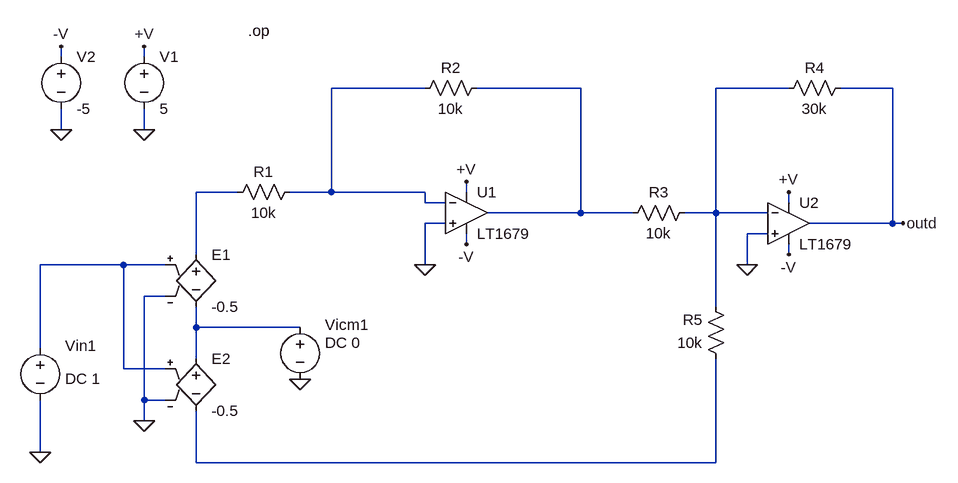
[diagram p0: schematic Etaj_1_AI_2AO_inv_op.asc]
Etaj_1_AI_2AO_inv_op.asc, the LTspice schematic file:
Version 4.1
SHEET 1 904 680
WIRE -480 -240 -480 -256
WIRE -352 -240 -352 -256
WIRE 80 -192 -64 -192
WIRE 320 -192 160 -192
WIRE 640 -192 528 -192
WIRE 800 -192 720 -192
WIRE -480 -128 -480 -160
WIRE -352 -128 -352 -160
WIRE -208 -32 -272 -32
WIRE -64 -32 -64 -192
WIRE -64 -32 -128 -32
WIRE 80 -32 -64 -32
WIRE 144 -32 144 -48
WIRE 80 -16 80 -32
WIRE 112 -16 80 -16
WIRE 640 -16 640 -32
WIRE 320 0 320 -192
WIRE 320 0 176 0
WIRE 400 0 320 0
WIRE 528 0 528 -192
WIRE 528 0 480 0
WIRE 608 0 528 0
WIRE 112 16 80 16
WIRE 800 16 800 -192
WIRE 800 16 672 16
WIRE 816 16 800 16
WIRE 608 32 576 32
WIRE 144 48 144 32
WIRE -272 64 -272 -32
WIRE 640 64 640 48
WIRE -384 80 -512 80
WIRE -320 80 -384 80
WIRE 80 80 80 16
WIRE 576 80 576 32
WIRE -320 128 -352 128
WIRE 528 144 528 0
WIRE -272 176 -272 144
WIRE -112 176 -272 176
WIRE -512 208 -512 80
WIRE -272 224 -272 176
WIRE -384 240 -384 80
WIRE -320 240 -384 240
WIRE -352 288 -352 128
WIRE -320 288 -352 288
WIRE -352 320 -352 288
WIRE -512 368 -512 288
WIRE -272 384 -272 304
WIRE 528 384 528 224
WIRE 528 384 -272 384
FLAG -352 -128 0
FLAG 144 -48 +V
FLAG -352 -256 +V
FLAG 144 48 -V
FLAG -480 -128 0
FLAG -480 -256 -V
FLAG 640 -32 +V
FLAG 640 64 -V
FLAG 816 16 outd
FLAG 80 80 0
FLAG 576 80 0
FLAG -512 368 0
FLAG -352 320 0
FLAG -112 256 0
DATAFLAG 800 16 ""
DATAFLAG 320 0 ""
DATAFLAG -240 -32 ""
DATAFLAG 400 384 ""
DATAFLAG -48 -32 ""
SYMBOL voltage -352 -256 R0
WINDOW 123 0 0 Left 2
WINDOW 39 0 0 Left 2
SYMATTR InstName V1
SYMATTR Value 5
SYMBOL voltage -480 -256 R0
WINDOW 123 0 0 Left 2
WINDOW 39 0 0 Left 2
SYMATTR InstName V2
SYMATTR Value -5
SYMBOL res -112 -48 R90
WINDOW 0 0 56 VBottom 2
WINDOW 3 32 56 VTop 2
SYMATTR InstName R1
SYMATTR Value 10k
SYMBOL res 176 -208 R90
WINDOW 0 0 56 VBottom 2
WINDOW 3 32 56 VTop 2
SYMATTR InstName R2
SYMATTR Value 10k
SYMBOL res 496 -16 R90
WINDOW 0 0 56 VBottom 2
WINDOW 3 32 56 VTop 2
SYMATTR InstName R3
SYMATTR Value 10k
SYMBOL res 736 -208 R90
WINDOW 0 0 56 VBottom 2
WINDOW 3 32 56 VTop 2
SYMATTR InstName R4
SYMATTR Value 30k
SYMBOL res 544 240 R180
WINDOW 0 36 76 Left 2
WINDOW 3 36 40 Left 2
SYMATTR InstName R5
SYMATTR Value 10k
SYMBOL voltage -512 192 R0
WINDOW 123 38 63 Left 2
WINDOW 39 0 0 Left 2
WINDOW 0 38 12 Left 2
WINDOW 3 -188 38 Left 2
SYMATTR Value2 DC 1
SYMATTR InstName Vin1
SYMATTR Value ""
SYMBOL e -272 48 R0
SYMATTR InstName E1
SYMATTR Value -0.5
SYMBOL e -272 208 R0
SYMATTR InstName E2
SYMATTR Value -0.5
SYMBOL voltage -112 160 R0
WINDOW 123 38 63 Left 2
WINDOW 39 0 0 Left 2
WINDOW 0 38 12 Left 2
WINDOW 3 38 40 Left 2
SYMATTR InstName Vicm1
SYMATTR Value DC 0
SYMBOL OpAmps\\LT1679 144 0 R0
SYMATTR InstName U1
SYMBOL OpAmps\\LT1679 640 16 R0
SYMATTR InstName U2
TEXT -192 -280 Left 2 !.op

The netlist it stands for:
* Etaj_1_AI_2AO_inv_op.asc
V1 +V 0 5
V2 -V 0 -5
R1 N001 N004 10k
R2 N002 N001 10k
R3 N003 N002 10k
R4 outd N003 30k
R5 N007 N003 10k
Vin1 N005 0 DC 1
E1 N004 N006 N005 0 -0.5
E2 N006 N007 N005 0 -0.5
Vicm1 N006 0 DC 0
* U1: LT1679 (symbol OpAmps\LT1679 not available, pins judged from their places): In+=0 In-=N001 V+=+V V-=-V OUT=N002
* U2: LT1679 (symbol OpAmps\LT1679 not available, pins judged from their places): In+=0 In-=N003 V+=+V V-=-V OUT=outd
.op
.backanno
.end